# EAGLE design FM-Radio-Simple-Receiver-Dip3 (EAGLE 7.2.0)
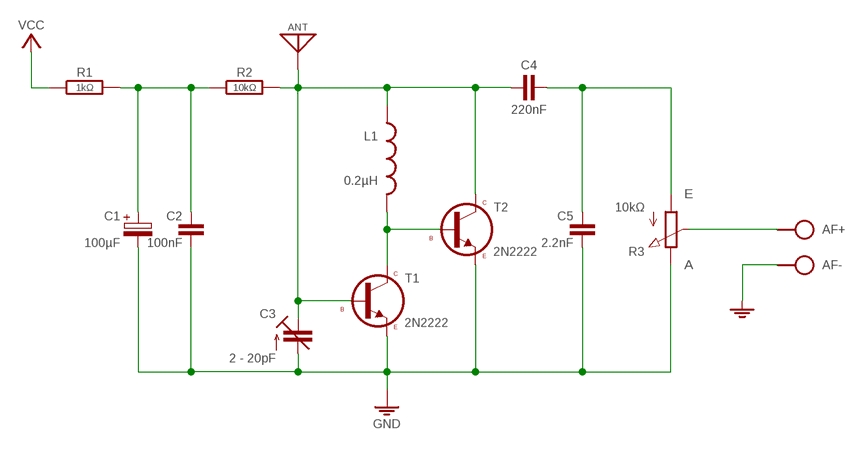
[diagram p0: schematic, sheet 1]

## Parts
AF  SPAD+-+-  [SPAD+-]
ANT  ANT  [SPAD]
BAT  VCC_GNDL  [SPAD-+]
C1  100µF  CPOLE2,5-5/V  [E2,5-5/V]
C2  100nF  C050-020X036/V  [C050-020X036/V]
C3  2 - 20pF  C-TR-PH201272222-808-2PIND  [TRIM-2222-808]
C4  220nF  C-H050-020X044  [C050-020X044]
C5  2.2nF  C050-020X036/V  [C050-020X036/V]
L1  0.2µH  L10/10Y  [L-10/10Y]
R1  1kΩ  R-H0204/10  [0204/10]
R2  10kΩ  R-H0204/10  [0204/10]
R3  10kΩ  POT-3P  [CONN-3P]
T1  2N2222  [TO92]
T2  2N2222  [TO92]

## Nets
GND: AF.1 BAT.1 C1.- C2.2 C3.2(A) C5.2 R3.3(E) T1.1(E) T2.1(E)
N$1: ANT.1 C3.3(E) C4.1 L1.1 R2.2 T1.2(B) T2.3(C)
N$2: C1.+ C2.1 R1.2 R2.1
N$3: C4.2 C5.1 R3.1(A)
N$5: L1.2 T1.3(C) T2.2(B)
N$6: AF.2 R3.2(S)
VCC: BAT.2 R1.1

## Library data of the parts
AF = pad:SPAD+-
ANT = pad:ANT
BAT = pad:VCC_GND
C1 = c:CPOL: POLARIZED CAPACITOR, European symbol
C2 C5 = c:C: CAPACITOR, European symbol
C3 = cap-trim:C-TR-PH20127
C4 = c:C-H
L1 = l:L: Potentiometers Beckman, Copal, Piher, Spectrol, Schukat Created by librarian@cadsoft.de
R1 R2 = r:R-H
R3 = r:POT
T1 T2 = t:2N2222

## Net classes
0 default: width 0.33 mm, clearance 0.1 mm

## Board
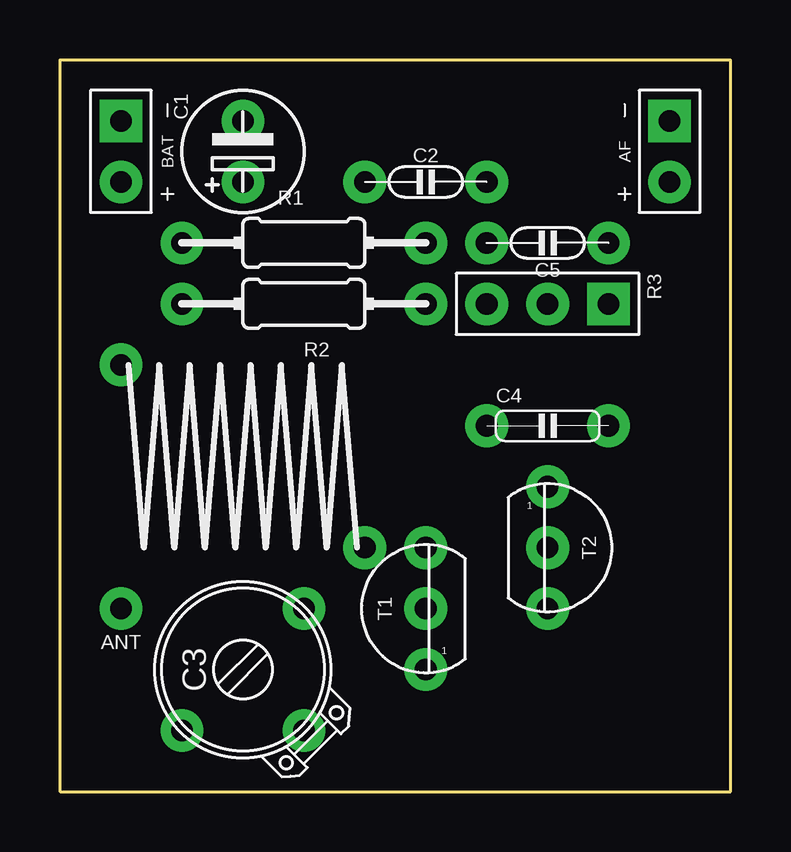
[diagram p1: board, top side]
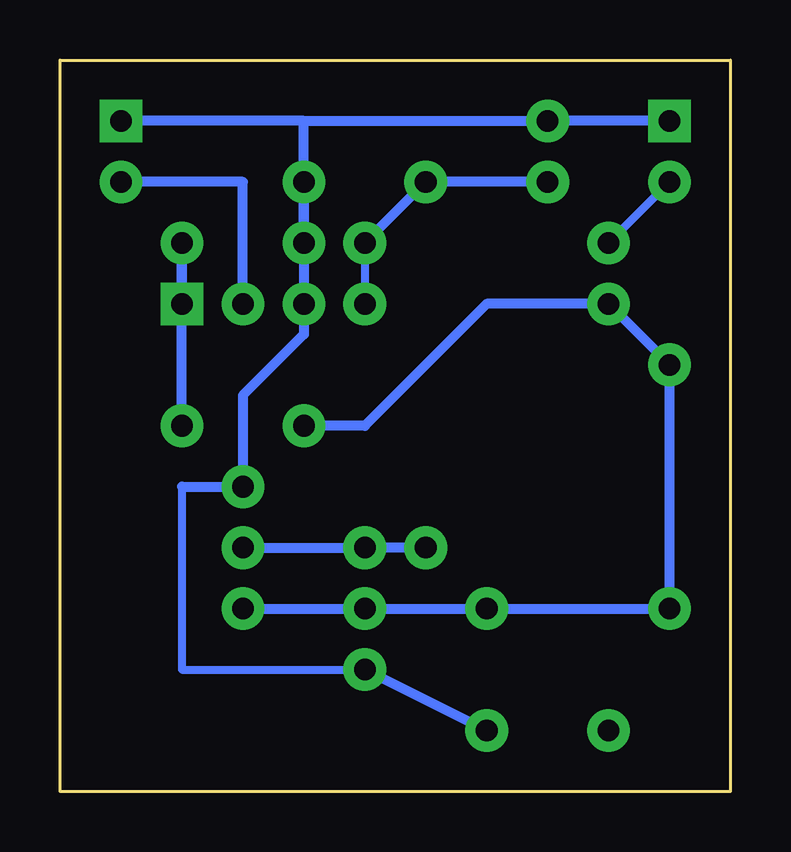
[diagram p2: board, bottom side, seen from below]

Size 27.94 x 30.48 mm. Coordinates in mm from the lower left corner, seen from the top.
Outline: 0,0 27.94,0 27.94,30.48 0,30.48 0,0
Copper layers (1*16): Top 0.035mm / dielectric 1.5mm / Bottom 0.035mm
Design rules "default *": minimum track width 10mil, minimum drill 0.61mm, track to track 8mil, track to pad 8mil, pad to pad 8mil, via to via 8mil, smd to smd 8mil, copper to edge 40mil, drill to drill 8mil, minimum pad ring 0mil, minimum via ring 8mil, stop-mask expansion 2mil, vias tented up to drill 15mil, thermal gap 10mil

### Footprints (pad centres in the part's own frame; a part is rotated, then mirrored left to right if it is on the bottom)
SPAD+- = drill 0.9 pad 1.778 square: 1 0,-1.27 | drill 0.9 pad 1.778: 2 0,1.27
SPAD = drill 0.9 pad 1.778: 1 0,0
SPAD-+ = drill 0.9 pad 1.778 square: 1 0,-1.27 | drill 0.9 pad 1.778: 2 0,1.27
E2,5-5/V = drill 0.9 pad 1.778: + 0,-1.27; - 0,1.27
C050-020X036/V = drill 0.9 pad 1.778: 1 0,-2.54; 2 0,2.54
TRIM-2222-808 = drill 0.9 pad 1.778: 1 -2.54,2.54; 2 -2.54,-2.54; 3 2.54,-2.54
C050-020X044 = drill 0.9 pad 1.778: 1 -2.54,0; 2 2.54,0
L-10/10Y = drill 0.9 pad 1.778: 1 5.08,2.54; 2 -2.54,-7.62
0204/10 = drill 0.9 pad 1.778: 1 -5.08,0; 2 5.08,0
CONN-3P = drill 0.9 pad 1.778 square: 1 0,2.54 | drill 0.9 pad 1.778: 2 0,0; 3 0,-2.54
TO92 = drill 0.9 pad 1.778: 1 0,2.54; 2 0,0; 3 0,-2.54

### Placement (x,y rotation side)
AF  25.4,26.67 180 top
ANT  2.54,7.62 90 top
BAT  2.54,26.67 180 top
C1  7.62,26.67 0 top
C2  15.24,25.4 270 top
C3  7.62,5.08 90 top
C4  20.32,15.24 0 top
C5  20.32,22.86 90 top
L1  5.08,12.7 90 top
R1  10.16,22.86 0 top
R2  10.16,20.32 180 top
R3  20.32,20.32 270 top
T1  15.24,7.62 180 top
T2  20.32,10.16 0 top

### Tracks (layer width: path | path; a pad name or v marks a point on that pad's centre or on a via)
GND
  Bottom 0.33: 22.86,12.7 22.86,5.08 T1.1
  Bottom 0.406: BAT.1 C1.- 17.78,27.94 | C2.2 R3.3 17.78,19.05 20.32,16.51 T2.1 22.86,12.7 | C3.2 T1.1 | C5.2 C2.2 | 17.78,27.94 AF.1 | C2.2 17.78,27.94
N$1
  Bottom 0.406: T2.3 T1.2 C3.3 ANT.1 L1.1 R2.2 10.16,20.32 15.24,15.24 C4.1
N$2
  Bottom 0.33: R1.2 R2.1
  Bottom 0.406: C1.+ C2.1 R1.2
N$3
  Bottom 0.406: R3.1 C5.1 C4.2
N$5
  Bottom 0.406: L1.2 T1.3 T2.2
N$6
  Bottom 0.406: R3.2 20.32,25.4 AF.2
VCC
  Bottom 0.33: BAT.2 R1.1